# Altium schematic sheet TPS922051.SchDoc: LED High Power - TPS922051
size B; SheetNumber: 13; SheetTotal: 14
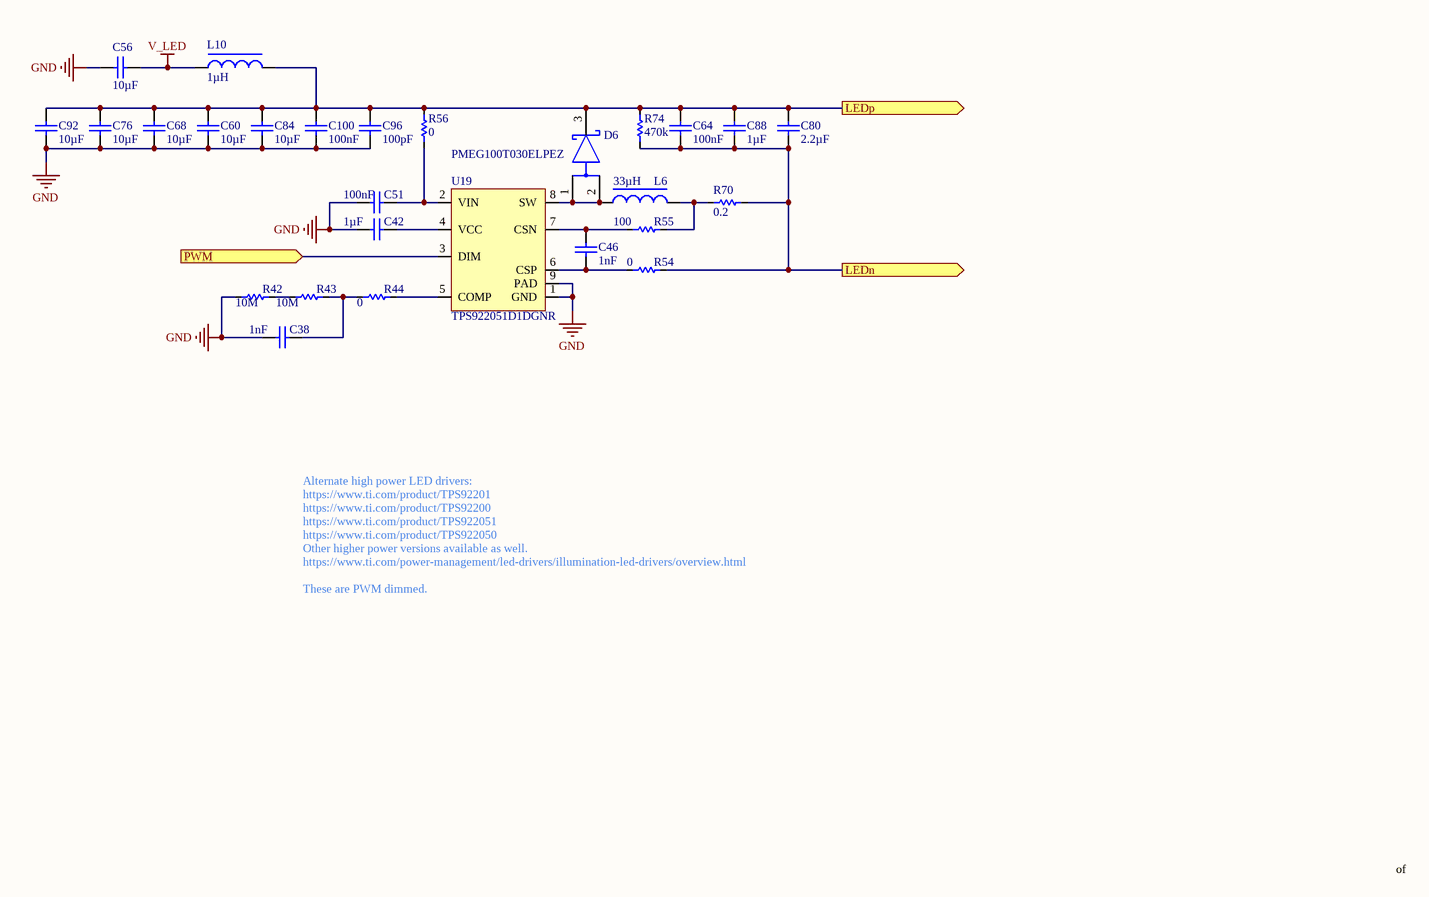
[diagram p0: TPS922051.SchDoc]

## Parts
C38  value 1nF  [CAPC1608X10N_0603_MED]  (hidden comment: C0603C102K5RACTU)
C42  value 1µF  [CAPC1608X10N_0603_MED]  (hidden comment: C1608X7R1C105K080AC)
C46  value 1nF  [CAPC1608X10N_0603_MED]  (hidden comment: C0603C102K5RACTU)
C51  value 100nF  [CAPC1608X10N_0603_MED]  (hidden comment: CC0603KRX7R0BB104)
C56  value 10µF  [CAPC2012X14N_0805_MED]  (hidden comment: GRM21BR61H106KE43L)
C60  value 10µF  [CAPC2012X14N_0805_MED]  (hidden comment: GRM21BR61H106KE43L)
C64  value 100nF  [CAPC1608X10N_0603_MED]  (hidden comment: CC0603KRX7R0BB104)
C68  value 10µF  [CAPC2012X14N_0805_MED]  (hidden comment: GRM21BR61H106KE43L)
C76  value 10µF  [CAPC2012X14N_0805_MED]  (hidden comment: GRM21BR61H106KE43L)
C80  value 2.2µF  [CAPC2012X14N_0805_MED]  (hidden comment: CGA4J3X7R1H225K125AE)
C84  value 10µF  [CAPC2012X14N_0805_MED]  (hidden comment: GRM21BR61H106KE43L)
C88  value 1µF  [CAPC2012X14N_0805_MED]  (hidden comment: CL21B105KBFNNNE)
C92  value 10µF  [CAPC2012X14N_0805_MED]  (hidden comment: GRM21BR61H106KE43L)
C96  value 100pF  [CAPC1608X10N_0603_MED]  (hidden comment: GCM1885C1H101JA16D)
C100  value 100nF  [CAPC1608X10N_0603_MED]  (hidden comment: CC0603KRX7R0BB104)
D6  PMEG100T030ELPEZ  [FP-SOT1289B-MFG]
L6  value 33µH  [SPM6545VT-330M-D-Footprint-1]  (hidden comment: SPM6545VT-330M-D)
L10  value 1µH  [WE-MAPI_3020]  (hidden comment: 74438336010)
R42  value 10M  [RESC1608X06N_0603_MED]  (hidden comment: RC0603JR-0710ML)
R43  value 10M  [RESC1608X06N_0603_MED]  (hidden comment: RC0603JR-0710ML)
R44  value 0  [RESC1608X06N_0603_MED]  (hidden comment: RC0603FR-070RL)
R54  value 0  [RESC1608X06N_0603_MED]  (hidden comment: RC0603FR-070RL)
R55  value 100  [RESC1608X06N_0603_MED]  (hidden comment: RC0603FR-07100RL)
R56  value 0  [RESC1608X06N_0603_MED]  (hidden comment: RC0603FR-070RL)
R70  value 0.2  [RESC640320X70_CRG2512_MFG]  (hidden comment: CRG2512-FZ-R200E-1)
R74  value 470k  [RESC1608X06N_0603_MED]  (hidden comment: RC0603FR-13470KL)
U19  TPS922051D1DGNR  [TPS92205x_TSOP65P490X110_HS-9N]

## Ports
LEDn (out), LEDp (out), PWM (in)

## Nets
GND: C38.1 C42.1 C51.1 C56.1 C60.1 C68.1 C76.1 C84.1 C92.1 C96.1 C100.1 R42.1 U19.1(GND) U19.9(PAD)
V_LED: C56.2 L10.1
LEDn: C64.1 C80.1 C88.1 R54.2 R70.2 R74.1 ; port LEDn
LEDp: C60.2 C64.2 C68.2 C76.2 C80.2 C84.2 C88.2 C92.2 C96.2 C100.2 D6.3(K) L10.2 R56.2 R74.2 ; port LEDp
PWM: U19.3(DIM) ; port PWM
NetC38_2: C38.2 R43.1 R44.2
NetC42_2: C42.2 U19.4(VCC)
NetC46_1: C46.1 R54.1 U19.6(CSP)
NetC46_2: C46.2 R55.1 U19.7(CSN)
NetC51_2: C51.2 R56.1 U19.2(VIN)
NetD6_1: D6.1(A) D6.2(A) L6.1 U19.8(SW)
NetL6_2: L6.2 R55.2 R70.1
NetR42_2: R42.2 R43.2
NetR44_1: R44.1 U19.5(COMP)

## Notes on the sheet
- Alternate high power LED drivers:
  https://www.ti.com/product/TPS92201
  https://www.ti.com/product/TPS92200
  https://www.ti.com/product/TPS922051
  https://www.ti.com/product/TPS922050
  Other higher power versions available as well.
  https://www.ti.com/power-management/led-drivers/illumination-led-drivers/overview.html
  These are PWM dimmed.
- of

## Library data of the parts
C38 C46 = CMP-001-00160-2: Ceramic Capacitor, Multilayer, Ceramic, 50V, 10% +Tol, 10% -Tol, X7R, 15% TC, 0.001uF, Surface Mount, 0603; RoHS Compliant: Yes; Mounting Technology: Surface Mount; Case/Package: 0603; Pins: 2; Min Operating Temperature: -55°C; Tolerance: 10%; Voltage Rating: 50V; Capacitor Type: Ceramic; Max Operating Temperature: 125°C; JLCPN: C2167129
C42 = CMP-001-00121-2: Ceramic Capacitor, Multilayer, Ceramic, 16V, 10% +Tol, 10% -Tol, X7R, 15% TC, 1uF, Surface Mount, 0603; Capacitor Type: Ceramic; RoHS Compliant: Yes; Min Operating Temperature: -55°C; Pins: 2; Tolerance: 10%; Max Operating Temperature: 125°C; Mounting Technology: Surface Mount; Voltage Rating: 16V; Case/Package: 0603; JLCPN: C59782
C51 C64 C100 = CMP-001-00102-4: Ceramic Capacitor, Multilayer, Ceramic, 100V, 10% +Tol, 10% -Tol, X7R, 15% TC, 0.1uF, Surface Mount, 0603; RoHS Compliant: Yes; Voltage Rating: 100V; Capacitor Type: Ceramic; Case/Package: 0603; Pins: 2; Min Operating Temperature: -55°C; Mounting Technology: Surface Mount; Max Operating Temperature: 125°C; JLCPN: C113803
C56 C60 C68 C76 C84 C92 = CMP-001-00169-2: Ceramic Capacitor, Multilayer, Ceramic, 10uF, 50V, 10%, X6S, 0805; Mounting Technology: Surface Mount; Case/Package: 0805; Tolerance: 10%; RoHS Compliant: Yes; Capacitor Type: Ceramic; Max Operating Temperature: 85°C; Min Operating Temperature: -55°C; Pins: 2; Voltage Rating: 50V; JLCPN: C440198
C80 = CMP-001-00170-2: Ceramic Capacitor, Multilayer, Ceramic, 2.2uF, 50V, 10%, X6S, 0805; Max Operating Temperature: 125°C; Min Operating Temperature: -55°C; Voltage Rating: 50V; Tolerance: 10%; Capacitor Type: Ceramic; RoHS Compliant: Yes; Pins: 2; Mounting Technology: Surface Mount; Case/Package: 0805; JLCPN: C125847
C88 = CMP-001-00171-2: Ceramic Capacitor, Multilayer, Ceramic, 1uF, 50V, 10%, XRS, 0805; Max Operating Temperature: 125°C; RoHS Compliant: Yes; Mounting Technology: Surface Mount; Case/Package: 0805; Tolerance: 10%; Pins: 2; Voltage Rating: 50V; Min Operating Temperature: -55°C; Capacitor Type: Ceramic; JLCPN: C28323
C96 = CMP-001-00168-2: Ceramic Capacitor, Multilayer, Ceramic, 50V, 5% Tol X7R, 100pF, Surface Mount, 0603; Max Operating Temperature: 125°C; Capacitor Type: Ceramic; RoHS Compliant: Yes; Min Operating Temperature: -55°C; Voltage Rating: 50V; Case/Package: 0603; Mounting Technology: Surface Mount; Pins: 2; Tolerance: 5%; JLCPN: C126543
D6 = CMP-004-00051-2: Schottky Rectifier, Single, 100V, 3A Rohs Compliant: Yes; Forward Current: 3A; Max Operating Temperature: 175°C; JLCPN: C3759829
L6 = CMP-006-00033-2: General Purpose Inductor, 33uH, 20%, 1 Element, Metal Composite-Core, SMD, 2826; Current Rating: 4.4A; Max Current Rating: 2.7A; Min Operating Temperature: -55°C; Tolerance: 20%; Max Operating Temperature: 155°C; Case/Package: 2826; JLCPN: C2847546
L10 = CMP-006-00032-2: Inductors, Fixed, WE-MAPI SMD 3020 1.0uH 4.0A 32mOhm; Current Rating: 4A; Tolerance: 20%; Self Resonant Frequency: 67MHz; Case/Package: SMD/SMT; Max Operating Temperature: 125°C; Pins: 2; Min Operating Temperature: -40°C; Mounting Technology: Surface Mount; JLCPN: C7423316
R42 R43 = CMP-009-00338-2: Fixed Resistor, Metal Glaze/thick Film, 0.1W, 10Mohm, 75V, 1% +/-Tol, 100ppm/Cel, Surface Mount, 0603; Power: 100mW; Tolerance: 5%; Voltage Rating: 50V; Min Operating Temperature: -55°C; Max Operating Temperature: 155°C; Pins: 2; Case/Package: 0603; RoHS Compliant: Yes; Mounting Technology: Surface Mount; JLCPN: C141675
R44 R54 R56 = CMP-009-00204-3: RC Series 0603 0.1 W 0 Ohm Jumper Surface Mount Thick Film Chip Resistor; Power: 100mW; Voltage Rating: 75V; Tolerance: 1%; Mounting Technology: Surface Mount; Pins: 2; Case/Package: 0603; Max Operating Temperature: 155°C; Min Operating Temperature: -55°C; RoHS Compliant: Yes; JLCPN: C100044
R55 = CMP-009-00319-2: Fixed Resistor, Metal Glaze/thick Film, 0.1W, 100ohm, 75V, 1% +/-Tol, 100ppm/Cel, Surface Mount, 0603; Power: 100mW; Voltage Rating: 50V; Tolerance: 1%; Mounting Technology: Surface Mount; RoHS Compliant: Yes; Case/Package: 0603; Max Operating Temperature: 155°C; Pins: 2; Min Operating Temperature: -55°C; JLCPN: C105588
R70 = CMP-009-00340-2: Res Metal Strip 2512 0.2 Ohm 1% 1W ±50ppm/°C Sulfur Resistant Pad SMD T/R Automotive AEC-Q200; Max Operating Temperature: 170°C; Min Operating Temperature: -55°C; Case/Package: 2512; Mounting Technology: Surface Mount; Tolerance: 1%; JLCPN: C309535
R74 = CMP-009-00339-2: Fixed Resistor, Metal Glaze/thick Film, 0.1W, 470Kohm, 75V, 1% +/-Tol, 100ppm/Cel, Surface Mount, 0603; Power: 100mW; Voltage Rating: 50V; Min Operating Temperature: -55°C; Tolerance: 1%; Mounting Technology: Surface Mount; Max Operating Temperature: 155°C; Pins: 2; RoHS Compliant: Yes; Case/Package: 0603; JLCPN: C114622
U19 = CMP-00024-00009-2: 65V, 2A buck LED driver with analog or PWM dimming options 8-HVSSOP -40 to 85; Pins: 8; Mounting Technology: SMT; JLCPN: C48922727